# EAGLE design PlacaBase (EAGLE 9.6.2)
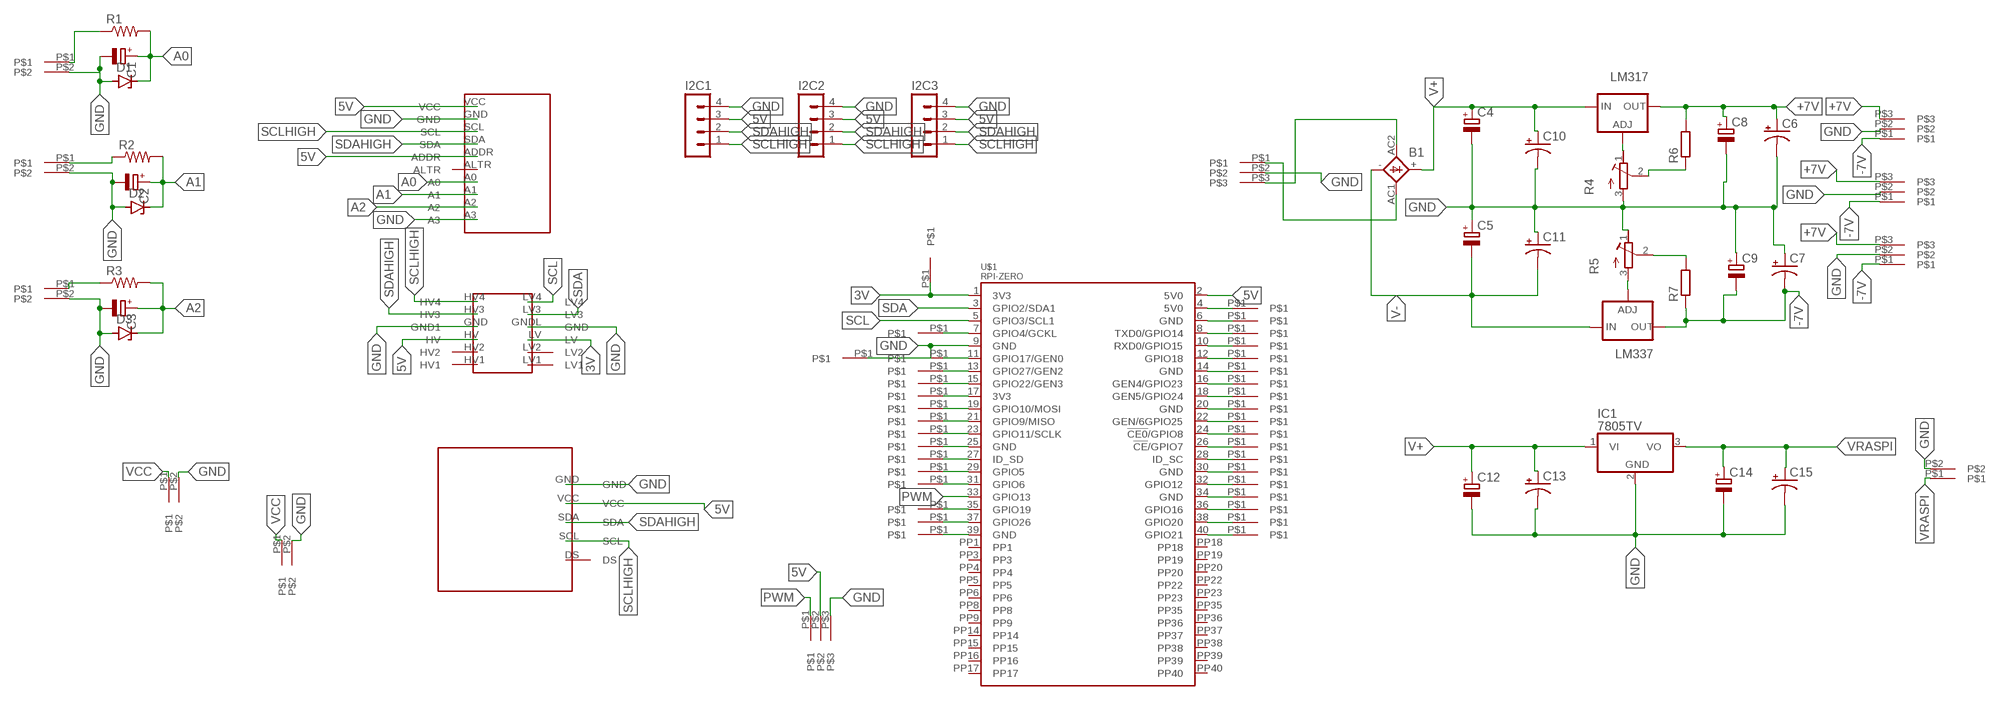
[diagram p0: schematic, sheet 1]

## Parts
5VIN  MOLEXPEQUEÑO2P  [MOLEXPEQUEÑO2P]
B1  KBL  [KBL]
C1  CPOL-EUE5-5  [E5-5]
C2  CPOL-EUE5-5  [E5-5]
C3  CPOL-EUE5-5  [E5-5]
C4  CPOL-EUE3.5-10  [E3,5-10]
C5  CPOL-EUE3.5-10  [E3,5-10]
C6  CPOL-USTAP5-45  [TAP5-45]
C7  CPOL-USTAP5-45  [TAP5-45]
C8  CPOL-EUTT2D7  [TT2D7]
C9  CPOL-EUTT2D7  [TT2D7]
C10  CPOL-USTAP5-45  [TAP5-45]
C11  CPOL-USTAP5-45  [TAP5-45]
C12  CPOL-EUE3.5-10  [E3,5-10]
C13  CPOL-USTAP5-45  [TAP5-45]
C14  CPOL-EUTT2D7  [TT2D7]
C15  CPOL-USTAP5-45  [TAP5-45]
D1  ZENER-DIODEDO34-7  [DO34Z7]
D2  ZENER-DIODEDO34-7  [DO34Z7]
D3  ZENER-DIODEDO34-7  [DO34Z7]
ENTRADAAC  MOLEXPEQUEÑO  [MOLEXPEQUEÑO]
I2C1  MA04-1  [MA04-1]
I2C2  MA04-1  [MA04-1]
I2C3  MA04-1  [MA04-1]
IC1  7805TV  [TO220V]
LM317  LM317TS  [317TS]
LM337  LM337TS  [337TS]
R1  R-US_0204/5  [0204/5]
R2  R-US_0204/5  [0204/5]
R3  R-US_0204/5  [0204/5]
R4  R-TRIMMT93YA  [RTRIMT93YA]
R5  R-TRIMMT93YA  [RTRIMT93YA]
R6  R-EU_0207/7  [0207/7]
R7  R-EU_0207/7  [0207/7]
U$1  RPI-ZERO  [RASP_PI_ZERO_BOARD_FULL]
U$2  ADS1115  [ADS1115]
U$3  RTC1307  [RTC1307]
U$4  CONVERSORLOGICO  [CONVERSORLOGICO]
U$5  MOLEXPEQUEÑO  [MOLEXPEQUEÑO]
U$6  MOLEXPEQUEÑO2P  [MOLEXPEQUEÑO2P]
U$7  MOLEXPEQUEÑO2P  [MOLEXPEQUEÑO2P]
U$8  MOLEXPEQUEÑO2P  [MOLEXPEQUEÑO2P]
U$9  MOLEXPEQUEÑO2P  [MOLEXPEQUEÑO2P]
U$10  MOLEXPEQUEÑO2P  [MOLEXPEQUEÑO2P]
U$11  PUENTE  [PUENTE]
U$12  PUENTE  [PUENTE]
U$13  MOLEXPEQUEÑO  [MOLEXPEQUEÑO]
U$14  MOLEXPEQUEÑO  [MOLEXPEQUEÑO]
U$15  MOLEXPEQUEÑO  [MOLEXPEQUEÑO]
U$16  PUENTE  [PUENTE]
U$17  PUENTE  [PUENTE]
U$18  PUENTE  [PUENTE]
U$19  PUENTE  [PUENTE]
U$20  PUENTE  [PUENTE]
U$21  PUENTE  [PUENTE]
U$22  PUENTE  [PUENTE]
U$23  PUENTE  [PUENTE]
U$24  PUENTE  [PUENTE]
U$25  PUENTE  [PUENTE]
U$26  PUENTE  [PUENTE]
U$27  PUENTE  [PUENTE]
U$28  PUENTE  [PUENTE]
U$29  PUENTE  [PUENTE]
U$30  PUENTE  [PUENTE]
U$31  PUENTE  [PUENTE]
U$32  PUENTE  [PUENTE]
U$33  PUENTE  [PUENTE]
U$34  PUENTE  [PUENTE]
U$35  PUENTE  [PUENTE]
U$36  PUENTE  [PUENTE]
U$37  PUENTE  [PUENTE]
U$38  PUENTE  [PUENTE]
U$39  PUENTE  [PUENTE]
U$40  PUENTE  [PUENTE]
U$41  PUENTE  [PUENTE]
U$42  PUENTE  [PUENTE]
U$43  PUENTE  [PUENTE]
U$44  PUENTE  [PUENTE]
U$45  PUENTE  [PUENTE]
U$46  PUENTE  [PUENTE]
U$47  PUENTE  [PUENTE]
U$48  PUENTE  [PUENTE]
U$49  PUENTE  [PUENTE]

## Nets
3V: U$1.1(3V3) U$4.LV U$48.P$1
3V3@2: U$1.17(3V3) U$17.P$1
5V: I2C1.3 I2C2.3 I2C3.3 U$1.2(5V0) U$2.ADDR U$2.VCC U$3.VCC U$4.HV U$5.P$2
5V0@2: U$1.4(5V0) U$46.P$1
+7V: C6.+ C8.+ LM317.2(OUT) R6.2 U$13.P$3 U$14.P$3 U$15.P$3
-7V: C7.- C9.- LM337.3(OUT) R7.1 U$13.P$1 U$14.P$1 U$15.P$1
A0: C1.+ D1.C R1.2 U$2.A0
A1: C2.+ D2.C R2.2 U$2.A1
A2: C3.+ D3.C R3.2 U$2.A2
AC1: B1.AC1(AC2) ENTRADAAC.P$1
AC2: B1.AC2(AC1) ENTRADAAC.P$3
GND: 5VIN.P$2 C1.- C2.- C3.- C4.- C5.+ C6.- C7.+ C8.- C9.+ C10.- C11.+ C12.- C13.- C14.- C15.- D1.A D2.A D3.A ENTRADAAC.P$2 I2C1.4 I2C2.4 I2C3.4 IC1.2(GND) R4.3(A) R5.1(E) U$1.9(GND) U$2.A3 U$2.GND U$3.GND U$4.GND(GND1) U$4.GNDL(GND) U$5.P$3 U$6.P$2 U$7.P$2 U$8.P$2 U$9.P$2 U$10.P$2 U$13.P$2 U$14.P$2 U$15.P$2 U$49.P$1
GND@2: U$1.25(GND) U$21.P$1
GND@3: U$1.39(GND) U$45.P$1
GND@4: U$1.14(GND) U$29.P$1
GND@5: U$1.20(GND) U$32.P$1
GND@6: U$1.30(GND) U$37.P$1
GND@7: U$1.34(GND) U$39.P$1
GND@8: U$1.6(GND) U$25.P$1
N$1: LM317.1(ADJ) R4.1(E)
N$2: U$1.8(TXD0/GPIO14) U$26.P$1
N$3: R1.1 U$6.P$1
N$4: R4.2(S) R6.1
N$5: R2.1 U$7.P$1
N$6: U$1.10(RXD0/GPIO15) U$27.P$1
N$7: U$1.12(GPIO18) U$28.P$1
N$8: R3.1 U$8.P$1
N$9: U$1.16(GEN4/GPIO23) U$30.P$1
N$10: U$1.18(GEN5/GPIO24) U$31.P$1
N$11: U$1.22(GEN/6GPIO25) U$33.P$1
N$12: U$1.24(!CE0!/GPIO8) U$34.P$1
N$13: LM337.1(ADJ) R5.3(A)
N$14: R5.2(S) R7.2
N$15: U$1.26(!CE!/GPIO7) U$35.P$1
N$16: U$1.28(ID_SC) U$36.P$1
N$17: U$1.32(GPIO12) U$38.P$1
N$18: U$1.36(GPIO16) U$40.P$1
N$19: U$1.38(GPIO20) U$41.P$1
N$20: U$1.40(GPIO21) U$42.P$1
N$21: U$1.11(GPIO17/GEN0) U$11.P$1
N$22: U$1.13(GPIO27/GEN2) U$12.P$1
N$23: U$1.15(GPIO22/GEN3) U$16.P$1
N$24: U$1.19(GPIO10/MOSI) U$18.P$1
N$25: U$1.21(GPIO9/MISO) U$19.P$1
N$26: U$1.23(GPIO11/SCLK) U$20.P$1
N$27: U$1.27(ID_SD) U$22.P$1
N$28: U$1.29(GPIO5) U$23.P$1
N$29: U$1.31(GPIO6) U$24.P$1
N$30: U$1.35(GPIO19) U$43.P$1
N$31: U$1.37(GPIO26) U$44.P$1
N$32: U$1.7(GPIO4/GCKL) U$47.P$1
PWM: U$1.33(GPIO13) U$5.P$1
SCL: U$1.5(GPIO3/SCL1) U$4.LV4
SCLHIGH: I2C1.1 I2C2.1 I2C3.1 U$2.SCL U$3.SCL U$4.HV4
SDA: U$1.3(GPIO2/SDA1) U$4.LV3
SDAHIGH: I2C1.2 I2C2.2 I2C3.2 U$2.SDA U$3.SDA U$4.HV3
V+: B1.+ C4.+ C10.+ C12.+ C13.+ IC1.1(VI) LM317.3(IN)
V-: B1.- C5.- C11.- LM337.2(IN)
VCC: 5VIN.P$1 U$10.P$1
VRASPI: C14.+ C15.+ IC1.3(VO) U$9.P$1
Unconnected: U$1.PP1 U$1.PP3 U$1.PP4 U$1.PP5 U$1.PP6 U$1.PP8 U$1.PP9 U$1.PP14 U$1.PP15 U$1.PP16 U$1.PP17 U$1.PP18 U$1.PP19 U$1.PP20 U$1.PP22 U$1.PP23 U$1.PP35 U$1.PP36 U$1.PP37 U$1.PP38 U$1.PP39 U$1.PP40 U$2.ALTR U$3.DS U$4.HV1 U$4.HV2 U$4.LV1 U$4.LV2

## Library data of the parts
5VIN U$6-U$10 = untitled:MOLEXPEQUEÑO2P
B1 = rectifier:KBL: DIOTEC RECTIFIER
C1-C3 = C PAG:CPOL-EU: POLARIZED CAPACITOR, European symbol; SPICEPREFIX: C
C4 C5 C8 C9 C12 C14 = R Pad Grand:CPOL-EU: POLARIZED CAPACITOR, European symbol; SPICEPREFIX: C
C6 C7 C10 C11 C13 C15 = R Pad Grand:CPOL-US: POLARIZED CAPACITOR, American symbol; SPICEPREFIX: C
D1-D3 = diode:ZENER-DIODE: Z-Diode
ENTRADAAC U$5 U$13-U$15 = untitled:MOLEXPEQUEÑO
I2C1-I2C3 = con-lstb:MA04-1: PIN HEADER; OC_FARNELL: unknown; OC_NEWARK: unknown
IC1 = TL074:78*: Positive VOLTAGE REGULATOR Source: http://cache.national.com/ds/LM/LM78L05.pdf http://www.fairchildsemi.com/ds/LM/LM7805.pdf
LM317 = v-reg:LM317TS: VOLTAGE REGULATOR
LM337 = v-reg:LM337TS: VOLTAGE REGULATOR
R1-R3 = C PAG:R-US_: RESISTOR, American symbol; SPICEPREFIX: R
R4 R5 = R Pad Grand:R-TRIMM: Trimm resistor; SPICEMODEL: X; SPICEPREFIXL: POT
R6 R7 = R Pad grande:R-EU_: RESISTOR, European symbol; SPICEPREFIX: R
U$1 = rpi-zero:RPI-ZERO
U$2 = R Pad Grand:ADS1115
U$3 = R Pad Grand:RTC1307
U$4 = R Pad Grand:CONVERSORLOGICO
U$11 U$12 U$16-U$49 = untitled:PUENTE

## Board
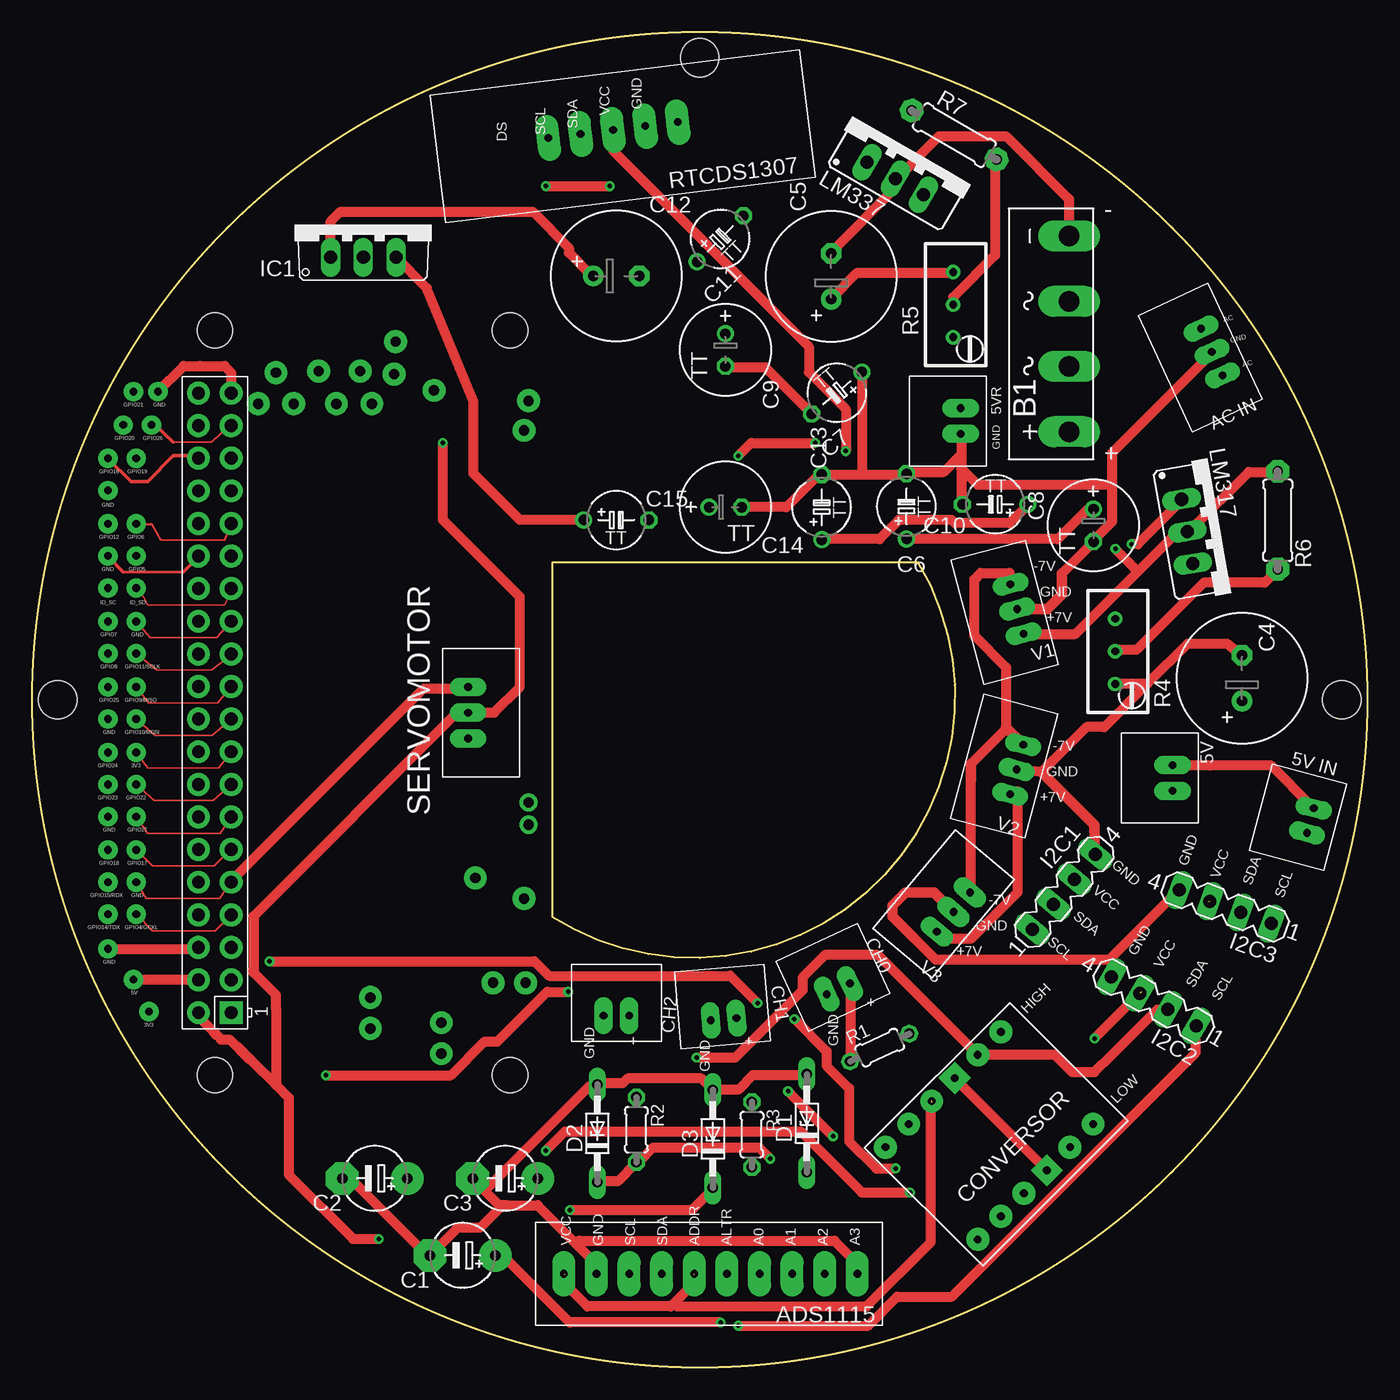
[diagram p1: board, top side]
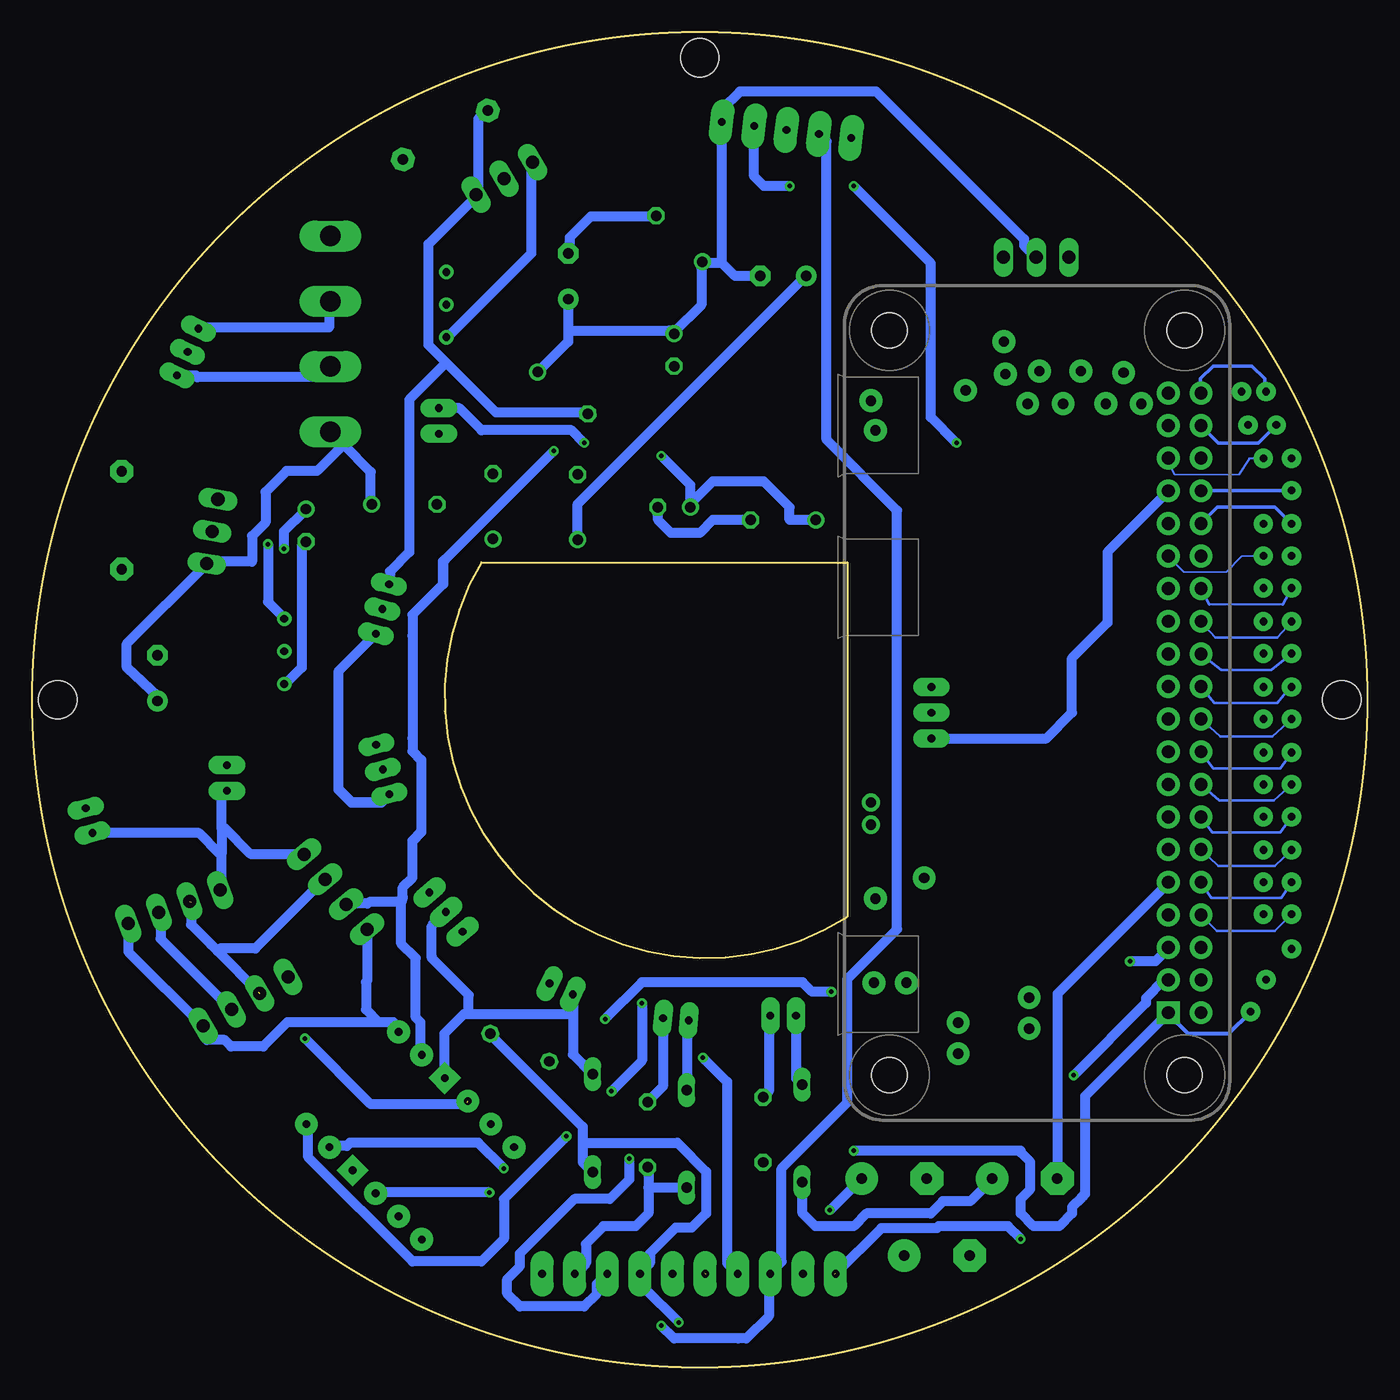
[diagram p2: board, bottom side, seen from below]

Size 104 x 104 mm. Coordinates in mm from the lower left corner, seen from the top.
Outline: 40.5,62.7 40.5,35.1 arc153 69,62.7 40.5,62.7
Outline: circle at 52,52 radius 52
Copper layers (1*16): Top 0.035mm / dielectric 1.5mm / Bottom 0.035mm
Design rules "default *": minimum track width 10mil, minimum drill 0.35mm, track to track 15mil, track to pad 15mil, pad to pad 15mil, via to via 15mil, smd to smd 6mil, copper to edge 40mil, drill to drill 6mil, minimum pad ring 10mil, minimum via ring 8mil, stop-mask expansion 4mil, vias tented up to drill 0mil, thermal gap 10mil
Holes 3 mm at 2,52 102,52 52,102

### Footprints (pad centres in the part's own frame; a part is rotated, then mirrored left to right if it is on the bottom)
MOLEXPEQUEÑO2P = drill 0.6 pad 1.422 long: P$1 0,0; P$2 2,0
KBL = drill 1.6 long: + -7.62,-1.27; - 7.62,-1.27; AC1 2.54,-1.27; AC2 -2.54,-1.27
E5-5 = drill 0.813 pad 2.54: + -2.54,0 | drill 0.813 pad 2.54 octagon: - 2.54,0
E3,5-10 = drill 0.813 pad 1.6: + -1.778,0 | drill 0.813 pad 1.6 octagon: - 1.778,0
TAP5-45 = drill 0.813: + -2.54,0 | drill 0.813 octagon: - 2.54,0
TT2D7 = drill 0.813: + -1.27,0 | drill 0.813 octagon: - 1.27,0
DO34Z7 = drill 0.813 long: A 3.81,0; C -3.81,0
MOLEXPEQUEÑO = drill 0.6 pad 1.422 long: P$1 0,0; P$2 2,0; P$3 4,0
MA04-1 = drill 1.016 long: 1 -3.81,0; 2 -1.27,0; 3 1.27,0; 4 3.81,0
TO220V = drill 1.016 long: 1 -2.54,-2.54; 2 0,-2.54; 3 2.54,-2.54
317TS = drill 1.016 long: 1 -2.54,-2.54; 2 0,-2.54; 3 2.54,-2.54
337TS = drill 1.016 long: 1 -2.54,-2.54; 2 0,-2.54; 3 2.54,-2.54
0204/5 = drill 0.813 octagon: 1 -2.54,0; 2 2.54,0
RTRIMT93YA = drill 0.61: 1 0,-2.54; 2 0,0; 3 0,2.54
0207/7 = drill 0.813 pad 1.778 octagon: 1 -3.81,0; 2 3.81,0
RASP_PI_ZERO_BOARD_FULL = drill 1 pad 1.778 square: 1 8.37,25.23 | drill 1 pad 1.778: 2 8.37,27.77; 3 10.91,25.23; 4 10.91,27.77; 5 13.45,25.23; 6 13.45,27.77; 7 15.99,25.23; 8 15.99,27.77; 9 18.53,25.23; 10 18.53,27.77; 11 21.07,25.23; 12 21.07,27.77; 13 23.61,25.23; 14 23.61,27.77; 15 26.15,25.23; 16 26.15,27.77; 17 28.69,25.23; 18 28.69,27.77; 19 31.23,25.23; 20 31.23,27.77; 21 33.77,25.23; 22 33.77,27.77; 23 36.31,25.23; 24 36.31,27.77; 25 38.85,25.23; 26 38.85,27.77; 27 41.39,25.23; 28 41.39,27.77; 29 43.93,25.23; 30 43.93,27.77; 31 46.47,25.23; 32 46.47,27.77; 33 49.01,25.23; 34 49.01,27.77; 35 51.55,25.23; 36 51.55,27.77; 37 54.09,25.23; 38 54.09,27.77; 39 56.63,25.23; 40 56.63,27.77 | drill 0.8 pad 1.778: PP1 10.699,4.832; PP3 7.593,8.858; PP4 7.133,14.38; PP5 55.796,23.124; PP6 10.699,2.301; PP8 5.177,8.858; PP9 9.549,14.38; PP14 58.327,18.407; PP15 55.796,14.265; PP16 55.796,20.363; PP17 58.212,21.743; PP18 55.796,17.027; PP19 58.327,15.186; PP20 56.832,9.434; PP35 17.257,2.416; PP36 60.628,12.425; PP37 56.026,2.071; PP38 53.726,2.416; PP39 58.097,12.54; PP40 18.867,6.212 | drill 0.8 pad 1.422: PP22 23.009,2.071; PP23 24.734,2.071 | hole 2.75: 3.5,3.5; 3.5,26.5; 61.5,3.5; 61.5,26.5
ADS1115 = drill 0.6 pad 1.778 long: A0 11.43,0; A1 13.97,0; A2 16.51,0; A3 19.05,0; ADDR 6.35,0; ALTR 8.89,0; GND -1.27,0; SCL 1.27,0; SDA 3.81,0; VCC -3.81,0
RTC1307 = drill 0.6 pad 1.778 long: DS 1.27,0; GND 11.43,0; SCL 3.81,0; SDA 6.35,0; VCC 8.89,0
CONVERSORLOGICO = drill 0.6 pad 1.778 square: GND 3.81,8.89; GNDL 3.81,-1.27 | drill 0.6 pad 1.778: HV 1.27,8.89; HV1 -3.81,8.89; HV2 -1.27,8.89; HV3 6.35,8.89; HV4 8.89,8.89; LV 1.27,-1.27; LV1 -3.81,-1.27; LV2 -1.27,-1.27; LV3 6.35,-1.27; LV4 8.89,-1.27
PUENTE = drill 0.6 pad 1.5: P$1 0,0

### Placement (x,y rotation side)
5VIN  88.82,46.91 270 top
B1  79.5,80.5 90 top
C1  33.53,8.72 180 top
C2  26.69,14.72 180 top
C3  36.85,14.72 180 top
C4  94.23,53.68 90 top
C5  62.23,84.98 90 top
C6  68.1,67.06 90 top
C7  62.67,75.9 220 top
C8  82.66,65.58 270 top
C9  54,79.24 270 top
C10  75.01,67.22 180 top
C11  53.6,87.9 45 top
C12  45.5,85 0 top
C13  61.5,67 90 top
C14  54,67 0 top
C15  45.5,66 0 top
D1  60.34,19.02 90 top
D2  44.02,18.23 90 top
D3  53.02,17.8 90 top
ENTRADAAC  91.04,80.9 295 top
I2C1  80.37,37.04 50 top
I2C2  87.37,28.51 150 top
I2C3  92.93,35.87 160 top
IC1  25.8,89 0 top
LM317  92.47,65.55 280 top
LM337  68.5,94.8 330 top
R1  66.02,24.91 25 top
R2  47.06,18.51 270 top
R3  56.06,18.13 270 top
R4  84.36,55.77 180 top
R5  71.74,82.77 180 top
R6  97.02,65.98 90 top
R7  71.82,95.98 330 top
U$1  40.73,19.26 90 top
U$2  45.23,7.29 0 top
U$3  38.94,95.6 7 top
U$4  75.45,13.56 45 top
U$5  33.96,48.99 90 top
U$6  63.7,29.9 205 top
U$7  46.51,27.4 180 top
U$8  54.86,27.2 185 top
U$9  72.32,74.71 270 top
U$10  99.82,43.56 255 top
U$11  8.1,40.3 0 top
U$12  8.1,42.9 0 top
U$13  73.05,37 230 top
U$14  76.2,61 285 top
U$15  77.2,48.5 255 top
U$16  8.1,45.4 0 top
U$17  8.1,47.9 0 top
U$18  8.1,50.5 0 top
U$19  8.1,53 0 top
U$20  8.1,55.6 0 top
U$21  8.1,58.1 0 top
U$22  8.1,60.7 0 top
U$23  8.1,63.2 0 top
U$24  8.1,65.7 0 top
U$25  5.9,32.6 0 top
U$26  5.9,35.3 0 top
U$27  5.9,37.8 0 top
U$28  5.9,40.3 0 top
U$29  5.9,42.9 0 top
U$30  5.9,45.4 0 top
U$31  5.9,47.9 0 top
U$32  5.9,50.5 0 top
U$33  5.9,53 0 top
U$34  5.9,55.6 0 top
U$35  5.9,58.1 0 top
U$36  5.9,60.7 0 top
U$37  5.9,63.2 0 top
U$38  5.9,65.7 0 top
U$39  5.9,68.3 0 top
U$40  5.9,70.8 0 top
U$41  7.1,73.4 0 top
U$42  7.9,76 0 top
U$43  8.1,70.8 0 top
U$44  9.3,73.4 0 top
U$45  9.8,76 0 top
U$46  7.9,30.2 0 top
U$47  8.1,35.3 0 top
U$48  9.1,27.7 0 top
U$49  8.1,37.8 0 top

### Tracks (layer width: path | path; a pad name or v marks a point on that pad's centre or on a via)
3V  (via drill 0.35)
  Top 0.762: v68.38,13.62 64.62,13.62 59.88,18.38 41.5,18.38 v40,16.88
  Bottom 0.305: 15.5,27.5 14,26 10.8,26 U$48.P$1
  Bottom 0.762: v68.38,13.62 77.12,13.62 U$4.LV | 27,16.88 v40,16.88 | 26.25,13.88 26.25,16 | 20.5,22.62 U$1.1 15.5,27.5
  Bottom 0.769: 26.25,13.88 27,13.12 27,12 26,11 24,11 23,12 23,12.5 22.25,13.25 22,13.5 22,21.12 20.5,22.62 | 26.25,16 27,16.75 27,16.88
3V3@2
  Top 0.102: U$17.P$1 9,46.7 14.55,46.7 U$1.17
5V  (via drill 0.35)  (5 unrouted)
  Top 0.762: 17.25,31 17.25,35.12 33,50.88 33.88,50.88 U$5.P$2 | 14.38,25.88 14.12,26.12 13,27.25 13,27.62 U$1.2 | 41.5,7.25 41.5,6.5 43.25,4.75 49.75,4.75 50,5 | 50,5 51.5,6.5 51.5,7.25 | U$4.HV 70,20.62 70,9.75 65,4.75 50.25,4.75 50,5 | v82.75,25.62 86.25,29.12 I2C2.3
  Top 0.769: 17.25,31 17.25,30.75 19,29 19,28 19,22 | U$5.P$2 36,51 38,53 38,60 32,66 v32,72 | v40,92 v45,92 | v27,10 25,10 20,15 20,21 19,22 | 16,25 17,24 | 17,24 19,22 | 14.12,26.12 14.72,25.54 15.38,25.54 16.91,24 17,24
  Bottom 0.762: v82.75,25.62 77.62,20.5 70.12,20.5 70.12,20.62 | 90.06,32.94 91.62,34.5 91.62,36.25 | 89.56,32.44 86.38,29.25 | 86.62,32.62 81.25,38 I2C1.3
  Bottom 0.769: v32,72 34,74 34,86 v40,92 | v45,92 47,92 47.76,92.76 U$3.VCC | v27,10 28,11 33.37,11 33.52,10.85 37.86,10.85 U$2.VCC | 86.62,32.62 89.38,32.62 89.56,32.44 90.06,32.94
5V0@2
  Top 0.762: U$46.P$1 12.93,30.2 U$1.4
+7V  (via drill 0.35)
  Top 0.762: U$13.P$3 71.19,33.38 73.12,33.38 76.75,37 76.75,44.88 U$15.P$3 | C6.+ 68.12,64.5 79.88,64.5 82.12,66.75 82.62,66.75 C8.+ | 86.12,62 89.12,65 89.88,65 LM317.2 90.25,65.25 94.75,69.75 97,69.75 R6.2 | 82.25,58.12 86.12,62 | U$14.P$3 81.23,57.14 | 86.12,62 v84.38,63.75
  Top 0.769: 81.23,57.14 81.26,57.14 82.25,58.12
  Bottom 0.762: v84.38,63.75 84.38,65.12 82.75,66.75 C8.+ | 80.12,45 80.12,54.25 U$14.P$3
  Bottom 0.813: U$15.P$3 76.8,44 79.12,44 80.12,45
-7V
  Top 0.762: 73.12,45.75 73.12,37 U$13.P$1 | 73.38,57 73.38,61.38 73.88,61.88 76.12,61.88 U$14.P$1 | C9.- 54,77.88 57.12,77.88 60.62,74.38 C7.-
  Top 0.769: 73.38,57 75.85,54.52 75.85,49.85 75.85,49.73 73.12,47
  Top 0.813: U$15.P$1 75.85,49.85 | 73.12,45.75 73.12,47
  Bottom 0.762: R7.1 68.62,97.88 69.25,97.25 69.25,91.5 69.38,91.38 LM337.3 69.62,91 73.12,87.5 73.12,79.62 71.75,78.25 | 71.75,78.25 67.88,74.38 60.75,74.38 C7.- | 71.75,78.25 74.62,75.38 74.62,63.5 76.12,62 U$14.P$1
A0  (via drill 0.35)
  Top 0.762: v53.62,3.5 41.88,3.5 36.75,8.62 36.12,8.62 C1.+
  Bottom 0.762: 61.12,17.5 61.12,18.75 68.25,25.88 R1.2 | 61.12,17.5 61.12,16 60.38,15.25 D1.C | 53.88,10.88 55.88,8.88 55.88,8.12 56.62,7.38 U$2.A0 56.38,7 56.38,6.25 v53.62,3.5 | 51.5,12 51.5,15.25 53.75,17.5 61.12,17.5
  Bottom 0.769: 51.5,12 52.62,10.88 53.88,10.88
A1  (via drill 0.35)
  Top 0.762: D2.C 44.12,14.5 45.62,14.5 47,15.88 R2.2 47.38,16.12 48.38,17.12 56.62,17.12 v57.5,16.25
  Bottom 0.762: 66,4.75 61,4.75 60,5.75 60,6.5 59.25,7.25 U$2.A1 | 66,8 66,8.88 61.75,13.12 59,13.12 | v57.5,16.25 57.5,15.38 | 30.94,12.94 29.25,14.62 C2.+ | 40,11 43,11 | 44,12 44,14.38 D2.C
  Bottom 0.769: 30.94,12.94 33.06,12.94 34,12 39,12 40,11 | 43,11 44,12 | 59,13.12 57.5,14.62 57.5,15.38 | 66,4.75 67,5.75 67,6.88 66,7.88 66,8
A2  (via drill 0.35)
  Top 0.762: v41.88,12.25 51.38,12.25 53,13.88 D3.C
  Bottom 0.762: D3.C 53.12,14 56,14 56,15.5 R3.2 | 60.88,9.62 60.88,8.12 61.62,7.38 U$2.A2 | v41.88,12.25 39.5,14.62 C3.+
  Bottom 0.769: 56,14 56,12 57,11 59.5,11 60.88,9.62
AC1
  Bottom 0.762: ENTRADAAC.P$1 91,81 80.88,81 80.88,83 B1.AC1
AC2
  Bottom 0.762: ENTRADAAC.P$3 92.62,77.25 91.25,77.25 91.12,77.12 80.88,77.12 80.88,77.88 B1.AC2
GND
  Top 0.102: U$49.P$1 8.9,36.55 14.62,36.55 15.5,37.88
  Top 0.762: D1.A 60.25,22.75 56.12,22.75 55,21.62 53.12,21.62 D3.A 52.75,21.88 52.12,22.5 46.38,22.5 46,22.12 44.12,22.12 D2.A 43.75,21.88 43.38,21.88 35.25,13.75 | U$4.GNDL 79,15.38 71.88,22.5 U$4.GND | U$5.P$3 33.88,52.88 30.5,52.88 15.5,37.88 U$1.9 | 42.38,9.62 39.38,12.62 37,12.62 36.38,12.62 35.62,13.38 35.25,13.75 | 42.38,9.62 43.88,8.12 43.88,7.38 U$2.GND | 35.25,13.75 34.38,14.62 C3.- | U$2.A3 64.25,7.38 64.25,8.12 62.5,9.88 42.62,9.88 42.38,9.62 | 33.12,10.88 31,8.75 C1.- 30.62,8.88 24.88,14.62 24.25,14.62 C2.- | 82.75,41.75 82.75,40 I2C1.4 | 84.12,31.75 84.12,32 89.25,37.12 I2C3.4 | 84.12,31.75 84.12,30.5 I2C2.4 | 80.19,61.81 82.62,64.25 C8.- 82.88,64.62 84.12,65.88 84.12,68.75 | 84.12,68.75 84.12,71.25 91.88,79 ENTRADAAC.P$2 | 90,56.38 93.07,56.38 C4.- | 85,53.25 84.38,53.25 R4.3 | 82.12,49.88 78.62,46.38 U$15.P$2 | C10.- 72.38,67.25 72.38,70 72.38,71 72.38,72.62 U$9.P$2 | 64.62,69.5 68,69.5 C6.- 68.38,69.75 71,69.75 | 64.62,69.5 61.5,69.5 C13.- 61.12,69.38 58.75,67 C14.- | R5.1 71.62,85.25 64.25,85.25 62.25,83.25 C5.+ | 64.62,69.5 64.62,77.5 C7.+ | 74,68.75 84.12,68.75 | 68.62,33.5 70.38,31.75 84.12,31.75 | 71.88,35.38 U$13.P$2
  Top 0.769: 85,53.25 86.88,53.25 | 90,56.38 86.88,53.25 | 86.88,53.25 83.5,49.88 82.12,49.88 | 71,69.75 72.25,71 72.38,71 | 72.38,70 73.62,68.75 74,68.75 | 37,12.62 36.62,12.62 34.88,10.88 33.12,10.88
  Top 0.813: U$14.P$2 79.07,59.07 80.19,60.19 80.19,61.81 | 82.75,41.75 82.75,42.25 78.62,46.38 | 68.62,33.5 67,35.12 67,36 68,37 70.25,37 71.88,35.38
  Bottom 0.762: D2.A 44.12,22.12 44.5,22.5 44.5,27.62 U$7.P$2 | D3.A 53,21.62 53,26.88 52.88,27 U$8.P$2 | 61.88,27.5 61.88,29 U$6.P$2 | 61.88,27.5 61.88,24.38 60.38,22.88 D1.A | 72.88,32 72.88,34.38 72,35.25 U$13.P$2 | 71.88,26 71.88,22.62 U$4.GND | 61.88,27.5 70,27.5 | U$1.9 15.5,37.75 24.12,29.12 24.12,14.75 C2.- | 5VIN.P$2 88.88,44.88 89.25,44.5 89.25,42 89.25,40 89.25,37.25 I2C3.4 | 91,41.62 99.25,41.62 U$10.P$2 | 87,40 82.88,40 I2C1.4 | R4.3 84.25,53.25 83,54.5 83,64 82.75,64.25 C8.- | 48,99.38 38.25,99.38 26.75,87.88 26.75,87.38 25.88,86.5 IC1.2 | 50.25,98 50.25,97 U$3.GND 50.25,96.62 50.25,86 51.75,86 C11.+ 51.88,85.62 51.88,82.75 54,80.62 C9.+ 54.38,80.75 62.25,80.75 | C15.- 50,66 | 55.25,66 55.25,67 C14.- | 62.25,80.75 62.25,83.12 C5.+ | 62.25,80.75 62.25,79.88 64.5,77.62 C7.+
  Bottom 0.769: 50.25,86 49.25,85 C12.- | 48,99.38 48.88,99.38 50.25,98 | 55.25,66 54.25,65 52,65 51,66 50,66 | 89.25,40 89.38,40 91,41.62 | 87,40 89,42 89.25,42 | 72.88,32 72.88,31.88 70,29 70,27.5 70.38,27.5 71.88,26
GND@2
  Top 0.102: U$21.P$1 9.2,56.85 14.39,56.85 U$1.25
GND@3
  Top 0.762: U$45.P$1 11.8,78 13.07,78 13.08,77.99 15,77.99 15.5,77.49 U$1.39
GND@4
  Bottom 0.2: U$29.P$1 6.8,41.65 12.09,41.65 U$1.14
GND@5
  Bottom 0.2: U$32.P$1 7.4,49.15 11.47,49.15 U$1.20
GND@6
  Top 0.2: 7.1,61.95 11.77,61.95
  Top 0.254: U$37.P$1 7.1,61.95 | 11.77,61.95 U$1.30
GND@7
  Bottom 0.254: U$39.P$1 12.93,68.3 U$1.34
GND@8
  Top 0.762: U$25.P$1 12.85,32.6 U$1.6
N$1  (via drill 0.35)
  Top 0.762: v85.62,64.12 86.12,64.12 89.5,67.5 LM317.1
  Bottom 0.762: v85.62,64.12 85.62,59.62 84.38,58.38 R4.1
N$2
  Bottom 0.2: U$26.P$1 7.2,34 11.71,34 U$1.8
N$3
  Top 0.762: R1.1 63.75,23.88 63.75,29.88 U$6.P$1
N$4
  Top 0.762: R4.2 84.38,55.88 86,55.88 91.25,61.12 96,61.12 97,62.12 R6.1
N$5
  Bottom 0.762: R2.1 47,21.12 46.62,21.5 46.62,27.38 U$7.P$1
N$6
  Bottom 0.2: U$27.P$1 6.7,36.55 12.17,36.55 U$1.10
N$7
  Bottom 0.2: U$28.P$1 7.2,39.05 11.63,39.05 U$1.12
N$8
  Bottom 0.762: R3.1 56,20.75 54.88,21.88 54.88,27.12 U$8.P$1
N$9
  Bottom 0.2: U$30.P$1 7.3,44.15 11.55,44.15 U$1.16
N$10
  Bottom 0.2: U$31.P$1 6.8,46.65 12.01,46.65 U$1.18
N$11
  Bottom 0.2: 6,53 7,51.75 11.93,51.75 U$1.22
  Bottom 0.762: U$33.P$1 6,53
N$12
  Bottom 0.2: U$34.P$1 7.5,54.3 11.39,54.3 U$1.24
N$13
  Bottom 0.762: R5.3 71.62,80.25 65.12,86.75 65.12,93.75 LM337.1
N$14
  Top 0.762: R5.2 71.75,82.88 71.75,83.38 75,86.62 75,94 R7.2
N$15
  Bottom 0.2: U$35.P$1 7,56.85 11.85,56.85 U$1.26
N$16
  Bottom 0.152: 6.6,59.4 12.31,59.4
  Bottom 0.2: U$36.P$1 6.6,59.4 | 12.31,59.4 U$1.28
N$17
  Bottom 0.254: U$38.P$1 7.2,67 11.69,67 U$1.32
N$18
  Top 0.254: U$40.P$1 7.7,69 9,69 11,71 12.77,71 U$1.36
N$19
  Bottom 0.254: U$41.P$1 8.5,72 11.61,72 U$1.38
N$20
  Bottom 0.254: 8,76.1 8,77 9,78 12,78 13,77 13,75.93 U$1.40
  Bottom 0.762: U$42.P$1 8,76.1
N$21
  Top 0.102: U$11.P$1 9.4,39.05 14.17,39.05 U$1.11
N$22
  Top 0.102: U$12.P$1 9,41.6 14.63,41.6 U$1.13
N$23
  Top 0.102: U$16.P$1 9.5,44.15 14.09,44.15 U$1.15
N$24
  Top 0.102: U$18.P$1 9.6,49.22 14.01,49.22 U$1.19
N$25
  Top 0.102: U$19.P$1 9.1,51.75 14.47,51.75 U$1.21
N$26
  Top 0.102: U$20.P$1 9.7,54.3 14,54.3 15.5,55.5
  Top 0.762: 15.5,55.5 U$1.23
N$27
  Top 0.102: 8.3,60.7 9,59.38 15,59.38 15.5,60.5 U$1.27
  Top 0.762: U$22.P$1 8.3,60.7
N$28
  Bottom 0.102: U$23.P$1 9.8,63.2 11,61.93 14.31,61.93 U$1.29
N$29
  Top 0.102: 10,64.45 15,64.45
  Top 0.15: U$24.P$1 9.3,65.7 10,64.45 | 15,64.45 15.5,65.5 U$1.31
N$30
  Bottom 0.102: 10,69.55 15,69.55
  Bottom 0.15: U$43.P$1 9.2,70.8 10,69.55 | 15,69.55 15.5,70.5 U$1.35
N$31
  Top 0.102: 11,72.07 14,72.07
  Top 0.15: 15.35,73.35 14,72.07
  Top 0.254: 9.6,73.4 11,72.07 | U$1.37 15.35,73.35
  Top 0.762: U$44.P$1 9.6,73.4
N$32
  Top 0.102: U$47.P$1 9.4,33.98 14.25,33.98 U$1.7
PWM
  Bottom 0.762: U$5.P$1 33.88,49 25,49 23,51 23,55.25 20.25,58 20.25,63.5 15.5,68.25 U$1.33
SCL  (via drill 0.35)
  Top 0.762: v58.88,21.5 v62.38,18 | v56.5,28.38 54.38,30.5 40.25,30.5 39.12,31.62 v18.5,31.62
  Bottom 0.762: 69,8.25 74.38,8.25 82.5,16.38 82.5,18.75 82.62,18.88 U$4.LV4 | 67.25,10 67.25,13.12 v62.38,18 | v58.88,21.5 56.5,23.88 v56.5,28.38 | v18.5,31.62 16.5,31.62 15.5,32.62 U$1.5
  Bottom 0.769: 67.25,10 69,8.25
SCLHIGH  (via drill 0.35)
  Top 0.762: v55,3.25 65.12,3.25 67.38,5.5 71.62,5.5 90.62,24.5 90.62,26.5 I2C2.1
  Bottom 0.762: 77.88,34 I2C1.1 | 75.5,26.25 U$4.HV4 75.88,26.88 77,26.88 84,26.88 | I2C3.1 96.5,34.5 96.5,32.38 90.75,26.62 I2C2.1 90.38,26.38 90.38,25.5 89,25.5 | U$3.SCL 42.62,96 42.12,95.5 42.12,72.25 36.62,66.75 36.62,34.12 40.5,30.25 40.5,20.62 45.62,15.5 45.62,8.25 46.5,7.38 U$2.SCL 46.62,7 46.62,4 | v55,3.25 54,2.25 49,2.25
  Bottom 0.769: 84,26.88 84.12,26.88 86,25 88.5,25 89,25.5 | I2C1.1 77.92,30.08 78,30 78,27.88 77,26.88 | 46.62,4 48.38,2.25 49,2.25
SDA  (via drill 0.35)
  Top 0.762: v67.25,15.5 65.75,15.5 63.62,17.62 63.62,21.75 61.88,23.5 61.88,24.62 v59.38,27.12 | v41.75,29.25 40.12,29.25 36.25,25.38 35.25,25.38 32.62,22.75 v22.88,22.75
  Bottom 0.762: v67.25,15.5 69.25,17.5 79.25,17.5 79.5,17.25 80.75,17.25 U$4.LV3 | v59.38,27.12 56.5,30 44,30 | v22.88,22.75 17.25,28.38 17.25,28.75 15.88,30.12 15.5,30.12 U$1.3
  Bottom 0.769: v41.75,29.25 43.25,29.25 44,30
SDAHIGH  (via drill 0.35)
  Top 0.762: 60.5,79.5 45.25,94.75 45.25,96.25 U$3.SDA | v51.75,24.12 54.75,24.12 60,29.38 60,30.38 61.75,32.12 65.88,32.12 73.62,24.38 U$4.HV3 74,24.38 79,24.38 | I2C2.2 87.62,27.88 84.12,24.38
  Top 0.769: 79,24.38 79.62,24.38 81,23 82.75,23 84.12,24.38 | 60.5,79.5 60.5,77.5 63.38,74.62 v63.38,71.38
  Bottom 0.762: I2C2.2 88.5,27.88 94,33.38 94,35.38 I2C3.2 | 75.25,36.25 77.75,36.25 77.88,36.12 79.5,36.12 I2C1.2 | 75.25,36.25 75.25,33 74.12,31.88 74.12,27.25 73.75,26.88 73.75,24.38 U$4.HV3 | v63.38,71.38 71.88,62.88 | 74.38,57 74.38,49 | 74.38,41 74.38,38.12 75.12,37.38 75.12,36.62 75.25,36.25 | U$2.SDA 49.88,8.12 49.88,22.25 v51.75,24.12
  Bottom 0.769: 74.38,57 74.38,58.62 72,61 | 73.69,41.69 73.69,47.31 74.38,48 74.38,49
  Bottom 0.813: 71.88,62.88 72,62.75 72,61 | 74.38,41 73.69,41.69
V+
  Top 0.762: 41.81,86.81 43.62,85 C12.+ | C13.+ 61.5,64.5 66,64.5 67.5,66 71.62,66 71.88,65.75 76.12,65.75 77.5,67.12 C10.+
  Top 0.769: IC1.1 23.26,89.26 24,90 39,90 41.81,87.19 41.81,86.81
  Bottom 0.762: C4.+ 94.23,52.27 96.62,54.5 96.62,56.38 90.5,62.5 LM317.3 90.12,62.75 86.88,62.75 86.88,64.75 85.81,65.81 | 79.75,71.88 77.62,69.75 77.62,67.25 C10.+ | 79.75,71.88 80.75,72.88 B1.+ | 79.75,71.88 81.81,69.81 | C13.+ 61.5,67.25 43.75,85 C12.+
  Bottom 0.769: 81.81,69.81 84.19,69.81 85.81,68.19 85.81,65.81
V-
  Top 0.762: C5.- 62.25,86.88 67.12,91.75 67.12,92.5 LM337.2 67.5,92.75 70.62,95.88 75.88,95.88 80.75,91 80.75,88.12 B1.-
  Bottom 0.762: 60,89.62 55.5,89.62 C11.- | 62.12,88 62.12,86.88 C5.-
  Bottom 0.769: 60,89.62 60.5,89.62 62.12,88
VCC
  Top 0.762: 5VIN.P$1 88.88,46.88 91.75,46.88 96.5,46.88 99.75,43.62 U$10.P$1
  Bottom 0.762: 88.75,46.88 5VIN.P$1
VRASPI  (via drill 0.35)
  Top 0.762: C15.+ 38,66 34.38,69.62 34.38,75.23 30.74,84.06 IC1.3 | v55,71 56,72 v61,72
  Bottom 0.762: C15.+ 45,66 | C14.+ 52.73,68.73 v55,71 | v61,72 62,73 69,73 70.71,74.71 U$9.P$1
  Bottom 0.769: 45,66 45,67 47,69 51,69 52.73,67.27 C14.+

### Text on the board
tNames: VCC | GND | DS | SCL | SDA | - | AC | GND | AC | 5VR | GPIO21 | GND | AC IN | GPIO20 | GPIO26 | GND | GPIO16 | GPIO19 | + | GND | GPIO12 | GPIO6 | GND | GPIO5 | -7V | GND | ID_SC | ID_SD | +7V | GPIO7 | GND | V1 | GPIO8 | GPIO11/SCLK | GPIO25 | GPIO9/MISO | GND | GPIO10/MOSI | -7V | GPIO24 | 3V3 | 5V | 5V IN | GND | GPIO23 | GPIO22 | +7V | SERVOMOTOR | GND | GPIO27 | V2 | GPIO18 | GPIO17 | GND | GND | VCC | SDA | GPIO15/RDX | GND | VCC | -7V | SCL | SDA | GPIO14/TDX | GPIO4/GCKL | GND | SCL | +7V | GND | GND | CH0 | V3 | VCC | SDA | 5V | GND | + | HIGH | SCL | CH1 | 3V3 | GND | CH2 | GND | + | + | LOW | VCC | GND | SCL | SDA | ADDR | ALTR | A0 | A1 | A2 | A3